# Altium schematic sheet MilliNut.SchDoc
size A3; PageSetup: Record=PageOptions|CenterHorizontal=True|CenterVertical=True|PrintScale=1.00|XCorrection=1.00|YCorrection=1.00|PrintKind=1|BorderSize=5000000|LeftOffset=0|BottomOffset=0|Orientation=2|PaperLength=1000|PaperWidth=1000|Scale=100|PaperSource=7|PrintQuality=-4|MediaType=1|DitherType=10|PaperKind=A3|PrintScaleMode=1
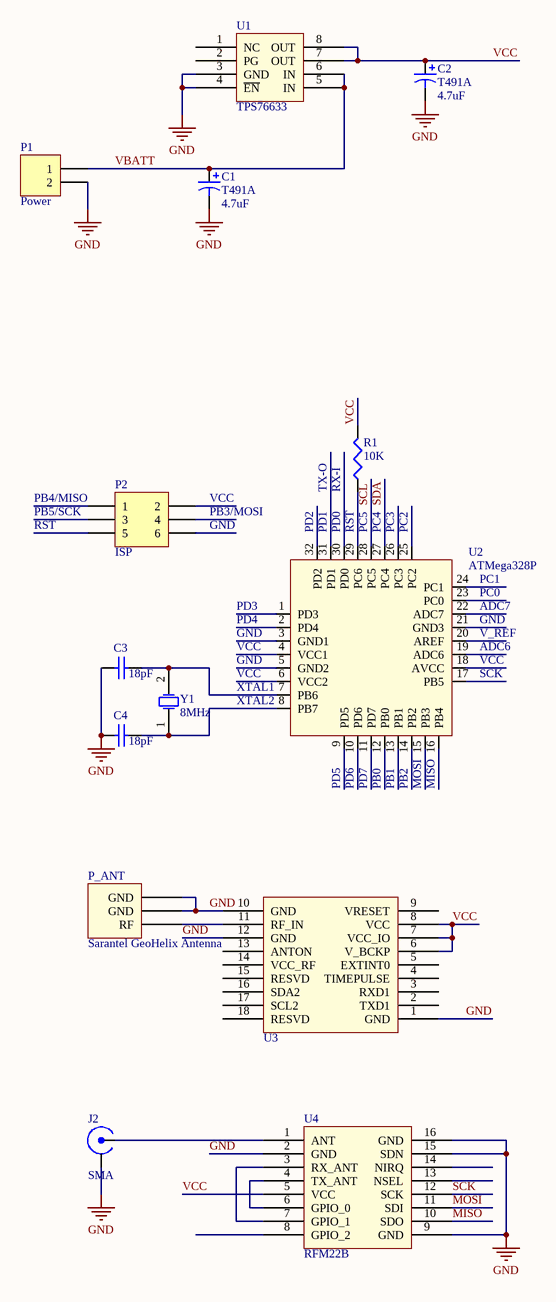
[diagram p0: MilliNut.SchDoc]

## Parts
C1  T491A  value 4.7uF  [A]
C2  T491A  value 4.7uF  [A]
C3  value 18pF  [1608[0603]]  (hidden comment: C0805)
C4  value 18pF  [1608[0603]]  (hidden comment: C0805)
J2  value SMA  [CON SMA PCB 90]  (hidden comment: SMA_L)
P1  Power  [HDR1X2]
P2  ISP  [HDR2X3]
P_ANT  Sarantel GeoHelix Antenna  [Sarantel SL1202RH]
R1  value 10K  [1608[0603]]  (hidden comment: Res3)
U1  TPS76633  [TPS76633]
U2  ATMega328P  [TQFP32]
U3  uBlox MAX-6Q  [MAX-6Q]  (value not drawn)
U4  RFM22B  [RFM22B]
Y1  8MHz  [ABM3_XTAL]

## Nets
GND: C1.2 C2.2 C3.1 C4.1 J2.2 P1.2 P2.6 P_ANT.2(GND) P_ANT.3(GND) U1.3(GND) U1.4(~{EN}) U2.3(GND1) U2.5(GND2) U2.21(GND3) U3.1(GND) U3.10(GND) U3.12(GND) U4.2(GND) U4.9(GND) U4.15(SDN) U4.16(GND)
ADC6: U2.19(ADC6)
ADC7: U2.22(ADC7)
MISO: U2.16(PB4) U4.10(SDO)
MOSI: U2.15(PB3) U4.11(SDI)
PB0: U2.12(PB0)
PB1: U2.13(PB1)
PB2: U2.14(PB2)
PB3/MOSI: P2.4
PB4/MISO: P2.1
PB5/SCK: P2.3
PC0: U2.23(PC0)
PC1: U2.24(PC1)
PC2: U2.25(PC2)
PC3: U2.26(PC3)
PC4: U2.27(PC4)  [also labelled SDA]
PC5: U2.28(PC5)  [also labelled SCL]
PD0: U2.30(PD0)  [also labelled RX-I]
PD1: U2.31(PD1)  [also labelled TX-O]
PD2: U2.32(PD2)
PD3: U2.1(PD3)
PD4: U2.2(PD4)
PD5: U2.9(PD5)
PD6: U2.10(PD6)
PD7: U2.11(PD7)
RST: P2.5 R1.1 U2.29(PC6)
SCK: U2.17(PB5) U4.12(SCK)
V_REF: U2.20(AREF)
VBATT: C1.1 P1.1 U1.5(IN) U1.6(IN)
VCC: C2.1 P2.2 R1.2 U1.7(OUT) U1.8(OUT) U2.4(VCC1) U2.6(VCC2) U2.18(AVCC) U3.6(V_BCKP) U3.7(VCC_IO) U3.8(VCC) U4.5(VCC)
XTAL1: C3.2 U2.7(PB6) Y1.2(OSC2)
XTAL2: C4.2 U2.8(PB7) Y1.1(OSC1)
NetJ2_1: J2.1 U4.1(ANT)
NetP_ANT_1: P_ANT.1(RF) U3.11(RF_IN)
NetU4_3: U4.3(RX_ANT) U4.7(GPIO_1)
NetU4_4: U4.4(TX_ANT) U4.6(GPIO_0)

Not connected (* = marked no-connect by the designer): U1 1(NC) 2(PG); U3 2(TXD1) 3(RXD1) 4(TIMEPULSE) 5(EXTINT0) 9(VRESET) 13(ANTON) 14(VCC_RF) 15(RESVD) 16(SDA2) 17(SCL2) 18(RESVD); U4 8(GPIO_2) 13(NSEL) 14(NIRQ)

## Library data of the parts
C1 C2 = T491A: Solid Tantalum Chip Capacitor, Standard T491 Series - Industrial Grade; Published: 17-Jul-2002; LatestRevisionDate: 19-Mar-2004; LatestRevisionNote: Silkscreen dimensions re-sized.; DatasheetDocument: Mar-2001; PackageDocument: Mar-2001; PackageReference: A; Publisher: Altium Limited; Code_JEITA: 3216-18; ComponentLink1Description: Manufacturer Link; ComponentLink1URL: http://www.kemet.com/; ComponentLink2Description: Datasheet; ComponentLink2URL: http://www.kemet.com/kemet/web/homepage/kechome.nsf/vapubfilesname/F3102TA.pdf/$file/F3102TA.pdf
C3 C4 = C0805: Ceramic Chip Capacitor - Standard; Note: Footprint corresponds to dimensions for bulk cassette packaging. This case size has tightened tolerances.; Published: 17-Jul-2002; LatestRevisionDate: 19-Mar-2004; LatestRevisionNote: Silkscreen size reduced.; DatasheetDocument: Mar-2001; PackageDocument: Mar-2001; PackageReference: 0805; Publisher: Altium Limited; Code_JEITA: 0805; Code_IPC: 2012[0805]; ComponentLink1Description: Manufacturer Link; ComponentLink1URL: http://www.kemet.com/; ComponentLink2Description: Datasheet; ComponentLink2URL: http://www.kemet.com/kemet/web/homepage/kechome.nsf/vapubfilesname/F3102TA.pdf/$file/F3102TA.pdf
J2 = SMA_L: Power Connector
P1 = Header 2: Header, 2-Pin; LatestRevisionDate: 17-Jul-2002; LatestRevisionNote: Re-released for DXP Platform.; Publisher: Altium Limited
P2 = Header 3X2: Header, 3-Pin, Dual row; LatestRevisionDate: 17-Jul-2002; LatestRevisionNote: Re-released for DXP Platform.; Publisher: Altium Limited
R1 = Res3: Resistor; Published: 8-Jun-2000; LatestRevisionDate: 29-May-2009; LatestRevisionNote: IPC-7351 Footprint Added.; PackageReference: J1-0603; Publisher: Altium Limited; PackageDescription: Chip Resistor
U4 = RFM22B-S2
Y1 = ECS-110-S-1: Crystal Oscillator; Published: 17-Jul-2002; DatasheetDocument: 18-Apr-2000; PackageReference: HC-49U; Publisher: Altium Limited; ComponentLink1Description: Manufacturer Link; ComponentLink1URL: http://www.ecsxtal.com/; ComponentLink2Description: Datasheet; ComponentLink2URL: http://www.ecsxtal.com/pdf2/HC49U.PDF